# Altium project BMS.PrjPcb (part 2 of 2)

## Sheet BMS_Balancing.SchDoc
size 431 x 279 mm; SheetNumber: 5; SheetTotal: 6
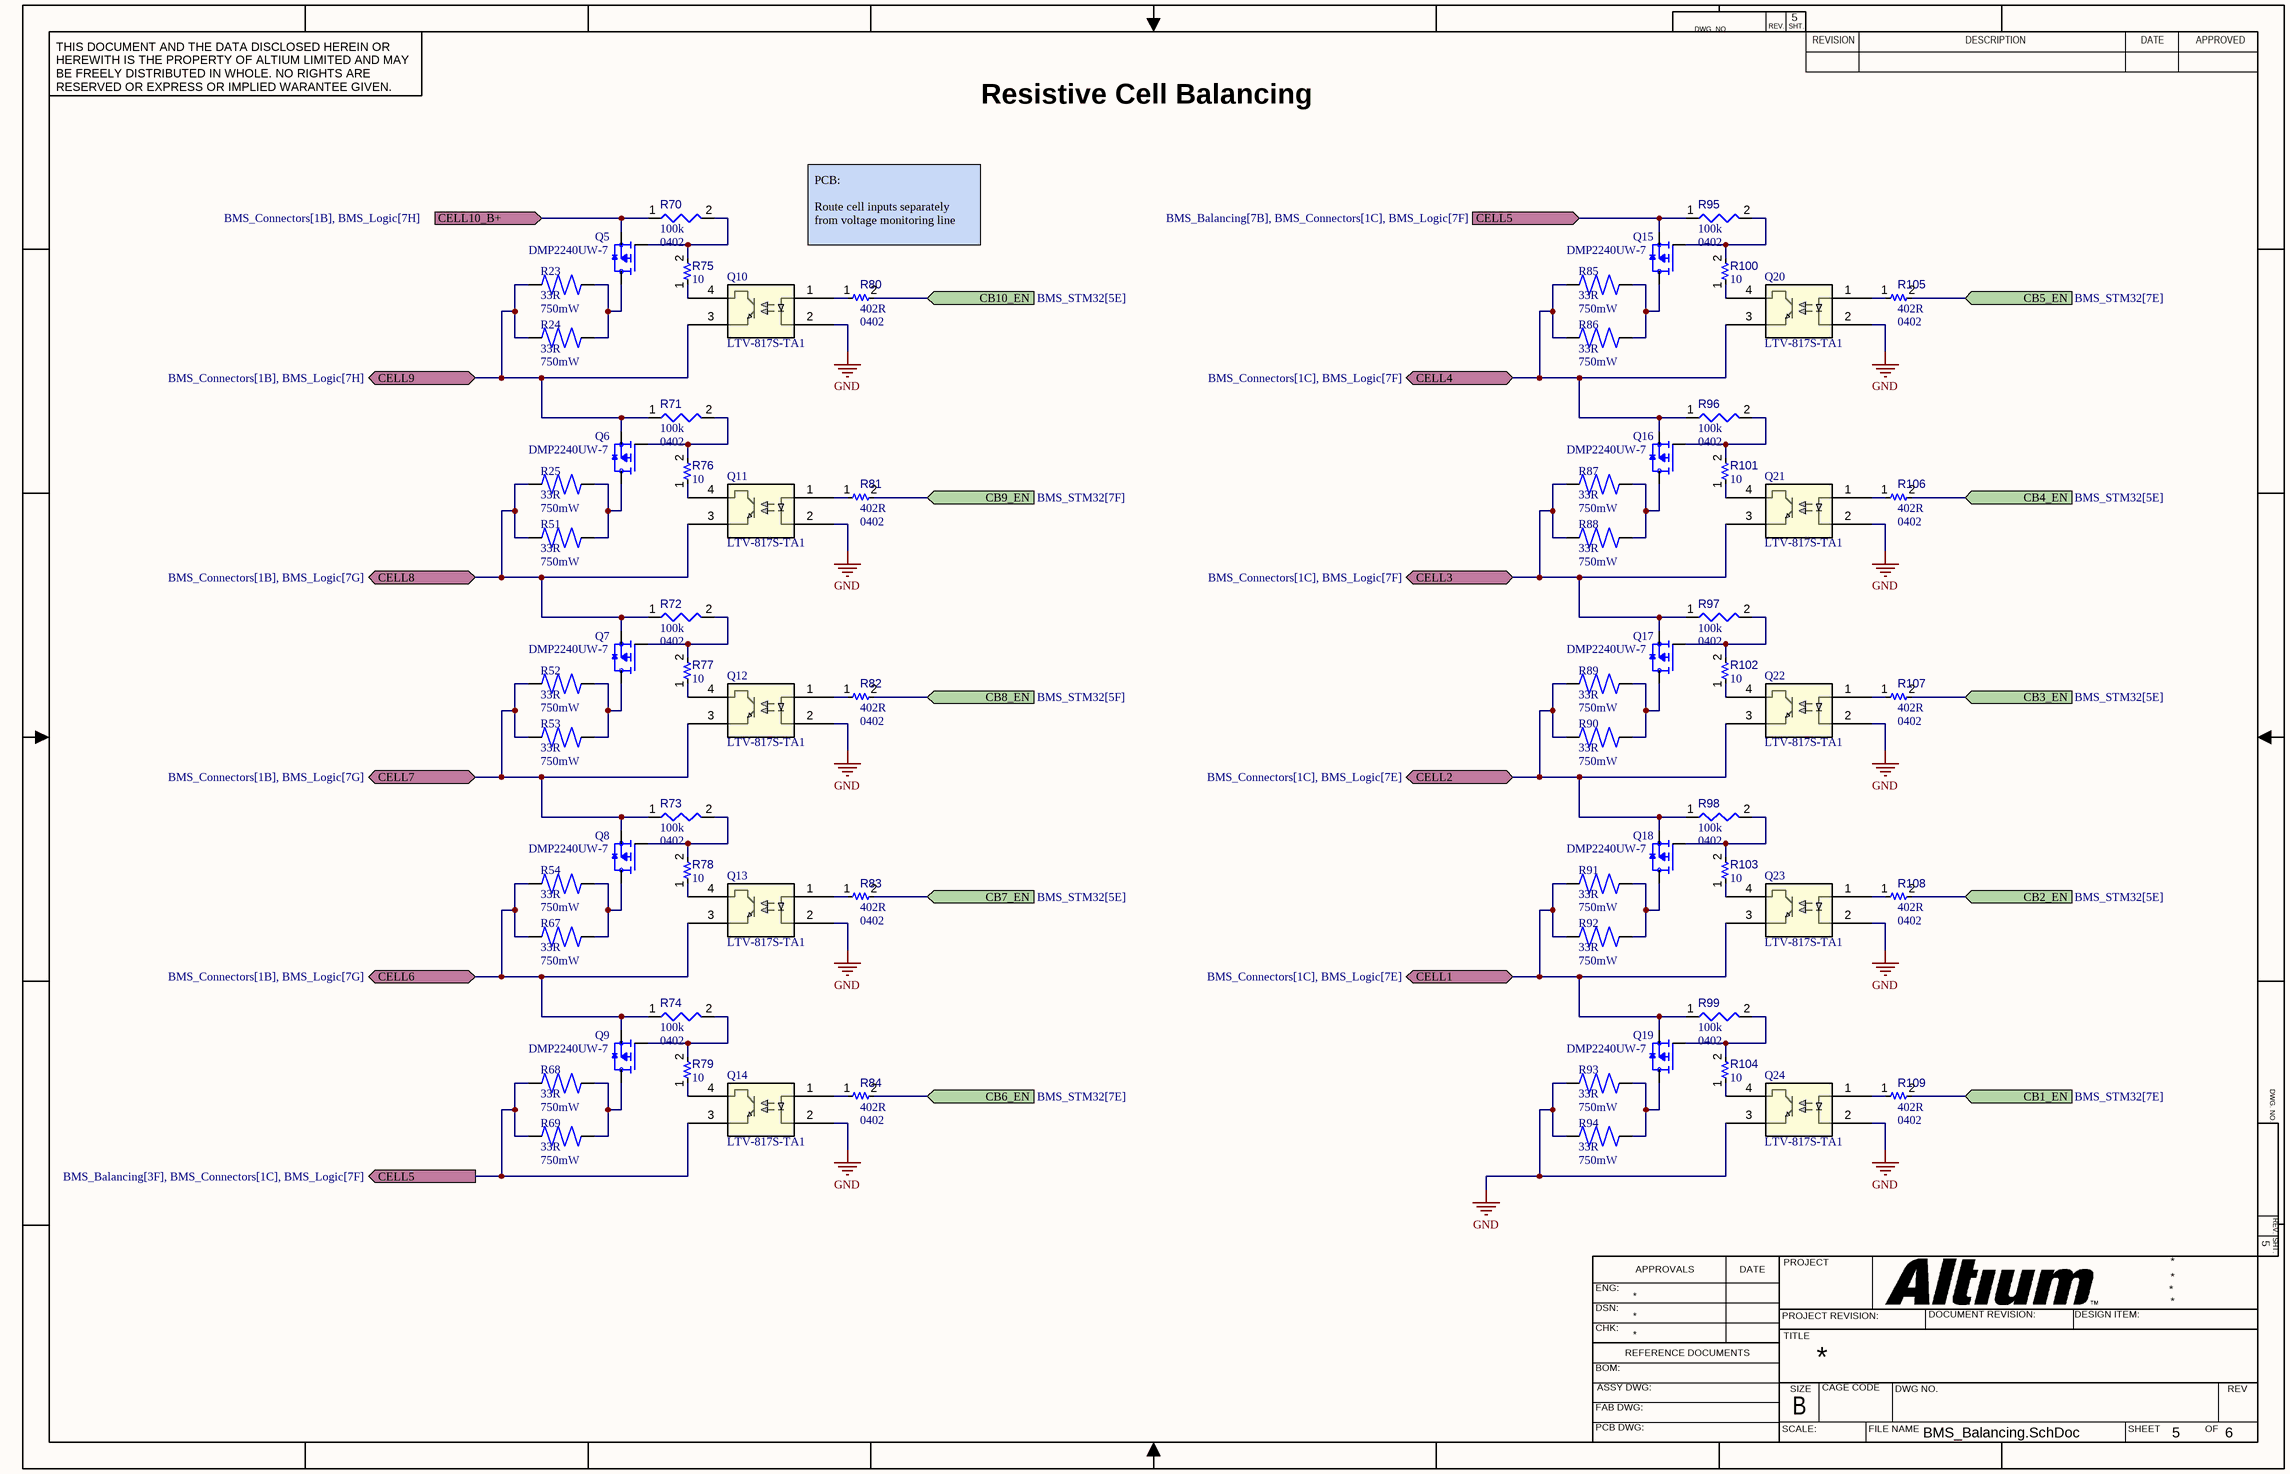
[diagram p7: BMS_Balancing.SchDoc]

### Parts
(Parts that share a designator on the sheet are numbered #1, #2 ... from top to bottom, then left to right.)
Q5  DMP2240UW-7  [SOT65P210X110-3N]
Q6  DMP2240UW-7  [SOT65P210X110-3N]
Q7  DMP2240UW-7  [SOT65P210X110-3N]
Q8  DMP2240UW-7  [SOT65P210X110-3N]
Q9  DMP2240UW-7  [SOT65P210X110-3N]
Q10  LTV-817S-TA1  [LTV-817S_LTO]
Q11  LTV-817S-TA1  [LTV-817S_LTO]
Q12  LTV-817S-TA1  [LTV-817S_LTO]
Q13  LTV-817S-TA1  [LTV-817S_LTO]
Q14  LTV-817S-TA1  [LTV-817S_LTO]
Q15  DMP2240UW-7  [SOT65P210X110-3N]
Q16  DMP2240UW-7  [SOT65P210X110-3N]
Q17  DMP2240UW-7  [SOT65P210X110-3N]
Q18  DMP2240UW-7  [SOT65P210X110-3N]
Q19  DMP2240UW-7  [SOT65P210X110-3N]
Q20  LTV-817S-TA1  [LTV-817S_LTO]
Q21  LTV-817S-TA1  [LTV-817S_LTO]
Q22  LTV-817S-TA1  [LTV-817S_LTO]
Q23  LTV-817S-TA1  [LTV-817S_LTO]
Q24  LTV-817S-TA1  [LTV-817S_LTO]
R23#2  value 33R  Power: 750mW  [RESC1632X70N]  (hidden comment: YAGEO AC0612FR-0733RL)
R24#2  value 33R  Power: 750mW  [RESC1632X70N]  (hidden comment: YAGEO AC0612FR-0733RL)
R25  value 33R  Power: 750mW  [RESC1632X70N]  (hidden comment: YAGEO AC0612FR-0733RL)
R51#1  value 33R  Power: 750mW  [RESC1632X70N]  (hidden comment: YAGEO AC0612FR-0733RL)
R52#1  value 33R  Power: 750mW  [RESC1632X70N]  (hidden comment: YAGEO AC0612FR-0733RL)
R53#1  value 33R  Power: 750mW  [RESC1632X70N]  (hidden comment: YAGEO AC0612FR-0733RL)
R54#1  value 33R  Power: 750mW  [RESC1632X70N]  (hidden comment: YAGEO AC0612FR-0733RL)
R67  value 33R  Power: 750mW  [RESC1632X70N]  (hidden comment: YAGEO AC0612FR-0733RL)
R68  value 33R  Power: 750mW  [RESC1632X70N]  (hidden comment: YAGEO AC0612FR-0733RL)
R69  value 33R  Power: 750mW  [RESC1632X70N]  (hidden comment: YAGEO AC0612FR-0733RL)
R70  value 100k  Case/Package: 0402  [RESC0402(1005)_L]  (hidden comment: CRCW0402100KJNED)
R71  value 100k  Case/Package: 0402  [RESC0402(1005)_L]  (hidden comment: CRCW0402100KJNED)
R72  value 100k  Case/Package: 0402  [RESC0402(1005)_L]  (hidden comment: CRCW0402100KJNED)
R73  value 100k  Case/Package: 0402  [RESC0402(1005)_L]  (hidden comment: CRCW0402100KJNED)
R74  value 100k  Case/Package: 0402  [RESC0402(1005)_L]  (hidden comment: CRCW0402100KJNED)
R75  value 10  [RESC0402(1005)_L]  (hidden comment: CL0402FN10RP)
R76  value 10  [RESC0402(1005)_L]  (hidden comment: CL0402FN10RP)
R77  value 10  [RESC0402(1005)_L]  (hidden comment: CL0402FN10RP)
R78  value 10  [RESC0402(1005)_L]  (hidden comment: CL0402FN10RP)
R79  value 10  [RESC0402(1005)_L]  (hidden comment: CL0402FN10RP)
R80  value 402R  Case/Package: 0402  [RESC0402(1005)_L]  (hidden comment: CR0402FF4020G)
R81  value 402R  Case/Package: 0402  [RESC0402(1005)_L]  (hidden comment: CR0402FF4020G)
R82  value 402R  Case/Package: 0402  [RESC0402(1005)_L]  (hidden comment: CR0402FF4020G)
R83  value 402R  Case/Package: 0402  [RESC0402(1005)_L]  (hidden comment: CR0402FF4020G)
R84  value 402R  Case/Package: 0402  [RESC0402(1005)_L]  (hidden comment: CR0402FF4020G)
R85  value 33R  Power: 750mW  [RESC1632X70N]  (hidden comment: YAGEO AC0612FR-0733RL)
R86  value 33R  Power: 750mW  [RESC1632X70N]  (hidden comment: YAGEO AC0612FR-0733RL)
R87  value 33R  Power: 750mW  [RESC1632X70N]  (hidden comment: YAGEO AC0612FR-0733RL)
R88  value 33R  Power: 750mW  [RESC1632X70N]  (hidden comment: YAGEO AC0612FR-0733RL)
R89  value 33R  Power: 750mW  [RESC1632X70N]  (hidden comment: YAGEO AC0612FR-0733RL)
R90  value 33R  Power: 750mW  [RESC1632X70N]  (hidden comment: YAGEO AC0612FR-0733RL)
R91  value 33R  Power: 750mW  [RESC1632X70N]  (hidden comment: YAGEO AC0612FR-0733RL)
R92  value 33R  Power: 750mW  [RESC1632X70N]  (hidden comment: YAGEO AC0612FR-0733RL)
R93  value 33R  Power: 750mW  [RESC1632X70N]  (hidden comment: YAGEO AC0612FR-0733RL)
R94  value 33R  Power: 750mW  [RESC1632X70N]  (hidden comment: YAGEO AC0612FR-0733RL)
R95  value 100k  Case/Package: 0402  [RESC0402(1005)_L]  (hidden comment: CRCW0402100KJNED)
R96  value 100k  Case/Package: 0402  [RESC0402(1005)_L]  (hidden comment: CRCW0402100KJNED)
R97  value 100k  Case/Package: 0402  [RESC0402(1005)_L]  (hidden comment: CRCW0402100KJNED)
R98  value 100k  Case/Package: 0402  [RESC0402(1005)_L]  (hidden comment: CRCW0402100KJNED)
R99  value 100k  Case/Package: 0402  [RESC0402(1005)_L]  (hidden comment: CRCW0402100KJNED)
R100  value 10  [RESC0402(1005)_L]  (hidden comment: CL0402FN10RP)
R101  value 10  [RESC0402(1005)_L]  (hidden comment: CL0402FN10RP)
R102  value 10  [RESC0402(1005)_L]  (hidden comment: CL0402FN10RP)
R103  value 10  [RESC0402(1005)_L]  (hidden comment: CL0402FN10RP)
R104  value 10  [RESC0402(1005)_L]  (hidden comment: CL0402FN10RP)
R105  value 402R  Case/Package: 0402  [RESC0402(1005)_L]  (hidden comment: CR0402FF4020G)
R106  value 402R  Case/Package: 0402  [RESC0402(1005)_L]  (hidden comment: CR0402FF4020G)
R107  value 402R  Case/Package: 0402  [RESC0402(1005)_L]  (hidden comment: CR0402FF4020G)
R108  value 402R  Case/Package: 0402  [RESC0402(1005)_L]  (hidden comment: CR0402FF4020G)
R109  value 402R  Case/Package: 0402  [RESC0402(1005)_L]  (hidden comment: CR0402FF4020G)

### Ports
CB1_EN (in, see BMS_STM32[7E]), CB2_EN (in, see BMS_STM32[5E]), CB3_EN (in, see BMS_STM32[5E]), CB4_EN (in, see BMS_STM32[5E]), CB5_EN (in, see BMS_STM32[7E]), CB6_EN (in, see BMS_STM32[7E]), CB7_EN (in, see BMS_STM32[5E]), CB8_EN (in, see BMS_STM32[5F]), CB9_EN (in, see BMS_STM32[7F]), CB10_EN (in, see BMS_STM32[5E]), CELL1 (bidir, see BMS_Connectors[1C], BMS_Logic[7E]), CELL2 (bidir, see BMS_Connectors[1C], BMS_Logic[7E]), CELL3 (bidir, see BMS_Connectors[1C], BMS_Logic[7F]), CELL4 (bidir, see BMS_Connectors[1C], BMS_Logic[7F]), CELL5 (in, see BMS_Balancing[7B], BMS_Connectors[1C], BMS_Logic[7F]), CELL5 (out, see BMS_Balancing[3F], BMS_Connectors[1C], BMS_Logic[7F]), CELL6 (bidir, see BMS_Connectors[1B], BMS_Logic[7G]), CELL7 (bidir, see BMS_Connectors[1B], BMS_Logic[7G]), CELL8 (bidir, see BMS_Connectors[1B], BMS_Logic[7G]), CELL9 (bidir, see BMS_Connectors[1B], BMS_Logic[7H]), CELL10_B+ (in, see BMS_Connectors[1B], BMS_Logic[7H])

### Nets
B+: Q5.2(S) R70.1 ; port CELL10_B+
GND: Q10.2 Q11.2 Q12.2 Q13.2 Q14.2 Q20.2 Q21.2 Q22.2 Q23.2 Q24.2 Q24.3 R93.1 R94.1
CB1_EN: R109.2 ; port CB1_EN
CB2_EN: R108.2 ; port CB2_EN
CB3_EN: R107.2 ; port CB3_EN
CB4_EN: R106.2 ; port CB4_EN
CB5_EN: R105.2 ; port CB5_EN
CB6_EN: R84.2 ; port CB6_EN
CB7_EN: R83.2 ; port CB7_EN
CB8_EN: R82.2 ; port CB8_EN
CB9_EN: R81.2 ; port CB9_EN
CB10_EN: R80.2 ; port CB10_EN
CELL1: Q19.2(S) Q23.3 R91.1 R92.1 R99.1 ; port CELL1
CELL2: Q18.2(S) Q22.3 R89.1 R90.1 R98.1 ; port CELL2
CELL3: Q17.2(S) Q21.3 R87.1 R88.1 R97.1 ; port CELL3
CELL4: Q16.2(S) Q20.3 R85.1 R86.1 R96.1 ; port CELL4
CELL5: Q14.3 Q15.2(S) R68.1 R69.1 R95.1 ; port CELL5
CELL6: Q9.2(S) Q13.3 R54#1.1 R67.1 R74.1 ; port CELL6
CELL7: Q8.2(S) Q12.3 R52#1.1 R53#1.1 R73.1 ; port CELL7
CELL8: Q7.2(S) Q11.3 R25.1 R51#1.1 R72.1 ; port CELL8
CELL9: Q6.2(S) Q10.3 R23#2.1 R24#2.1 R71.1 ; port CELL9
NetQ5_1: Q5.1(G) R70.2 R75.2
NetQ5_3: Q5.3(D) R23#2.2 R24#2.2
NetQ6_1: Q6.1(G) R71.2 R76.2
NetQ6_3: Q6.3(D) R25.2 R51#1.2
NetQ7_1: Q7.1(G) R72.2 R77.2
NetQ7_3: Q7.3(D) R52#1.2 R53#1.2
NetQ8_1: Q8.1(G) R73.2 R78.2
NetQ8_3: Q8.3(D) R54#1.2 R67.2
NetQ9_1: Q9.1(G) R74.2 R79.2
NetQ9_3: Q9.3(D) R68.2 R69.2
NetQ10_1: Q10.1 R80.1
NetQ10_4: Q10.4 R75.1
NetQ11_1: Q11.1 R81.1
NetQ11_4: Q11.4 R76.1
NetQ12_1: Q12.1 R82.1
NetQ12_4: Q12.4 R77.1
NetQ13_1: Q13.1 R83.1
NetQ13_4: Q13.4 R78.1
NetQ14_1: Q14.1 R84.1
NetQ14_4: Q14.4 R79.1
NetQ15_1: Q15.1(G) R95.2 R100.2
NetQ15_3: Q15.3(D) R85.2 R86.2
NetQ16_1: Q16.1(G) R96.2 R101.2
NetQ16_3: Q16.3(D) R87.2 R88.2
NetQ17_1: Q17.1(G) R97.2 R102.2
NetQ17_3: Q17.3(D) R89.2 R90.2
NetQ18_1: Q18.1(G) R98.2 R103.2
NetQ18_3: Q18.3(D) R91.2 R92.2
NetQ19_1: Q19.1(G) R99.2 R104.2
NetQ19_3: Q19.3(D) R93.2 R94.2
NetQ20_1: Q20.1 R105.1
NetQ20_4: Q20.4 R100.1
NetQ21_1: Q21.1 R106.1
NetQ21_4: Q21.4 R101.1
NetQ22_1: Q22.1 R107.1
NetQ22_4: Q22.4 R102.1
NetQ23_1: Q23.1 R108.1
NetQ23_4: Q23.4 R103.1
NetQ24_1: Q24.1 R109.1
NetQ24_4: Q24.4 R104.1

### Notes on the sheet
- Resistive Cell Balancing
- PCB:
  Route cell inputs separately from voltage monitoring line
- DWG. NO.
- REV.
- SHT.
- THIS DOCUMENT AND THE DATA DISCLOSED HEREIN OR HEREWITH IS THE PROPERTY OF ALTIUM LIMITED AND MAY BE FREELY DISTRIBUTED IN WHOLE. NO RIGHTS ARE RESERVED OR EXPRESS OR IMPLIED WARANTEE GIVEN.
- REVISION
- DESCRIPTION
- DATE
- APPROVED
- ENG:
- APPROVALS
- PROJECT
- DSN:
- CHK:
- REFERENCE DOCUMENTS
- PROJECT REVISION:
- TITLE
- DOCUMENT REVISION:
- DESIGN ITEM:
- BOM:
- FAB DWG:
- PCB DWG:
- ASSY DWG:
- SCALE:
- SIZE
- B
- CAGE CODE
- FILE NAME
- DWG NO.
- SHEET
- OF
- REV

### Library data of the parts
Q5-Q9 Q15-Q19 = CMP-147-000000-1: P-Channel Enhancement FET SOT-323; MF: Diodes Inc.; Package: SOT-323 Diodes Inc.; SnapEDA_Link: https://www.snapeda.com/parts/DMP2240UW-7/Diodes+Inc./view-part/?ref=snap; Check_prices: https://www.snapeda.com/parts/DMP2240UW-7/Diodes+Inc./view-part/?ref=eda; Value: *; Pin Count: 3; Source: DMP2240UW-7.SchLib; MP: DMP2240UW-7; Component Type: Standard; Design Item ID: DMP2240UW-7
Q10-Q14 Q20-Q24 = CMP-143-000000-2: No Description Available; Manufacturer_Name: LITE-ON; Source: LTV-817S-TA1.SchLib; RefDes: RefDes; Design Item ID: LTV-817S-TA1; Copyright: Copyright (C) 2025 Ultra Librarian. All rights reserved.; Type: Type; Manufacturer_Part_Number: LTV-817S-TA1
R23#2 R24#2 R25 R51#1 R52#1 R53#1 R54#1 R67-R69 R85-R94 = CMP-009-00178-3: 750 mOhms Â±1% 1W Chip Resistor 0612 (1632 Metric) Automotive AEC-Q200, Current Sense, Moisture Resistant Thick Film; MF: Vishay Dale; Case/Package: 1632 Vishay; SnapEDA_Link: https://www.snapeda.com/parts/RCWE0612R750FKEA/Vishay+Dale/view-part/?ref=snap; Check_prices: https://www.snapeda.com/parts/RCWE0612R750FKEA/Vishay+Dale/view-part/?ref=eda; Source: RCWE0612R750FKEA.SchLib; MP: RCWE0612R750FKEA; Design Item ID: RCWE0612R750FKEA
R70-R74 R95-R99 = CMP-009-00064-2: 100K 0.063W 1% 0402 (1005 Metric)  SMD; Power: 63mW; Mounting Technology: SMT; Pins: 2; Tolerance: 1%
R75-R84 R100-R109 = CMP-009-00065-4: 100R 0.063W 1% 0402 (1005 Metric)  SMD; Power: 63mW; Tolerance: 1%; Pins: 2; Mounting Technology: SMT
  R75-R79 R100-R104: Case/Package: 0402

## Sheet BMS_Protection.SchDoc
size 431 x 279 mm; SheetNumber: 6; SheetTotal: 5
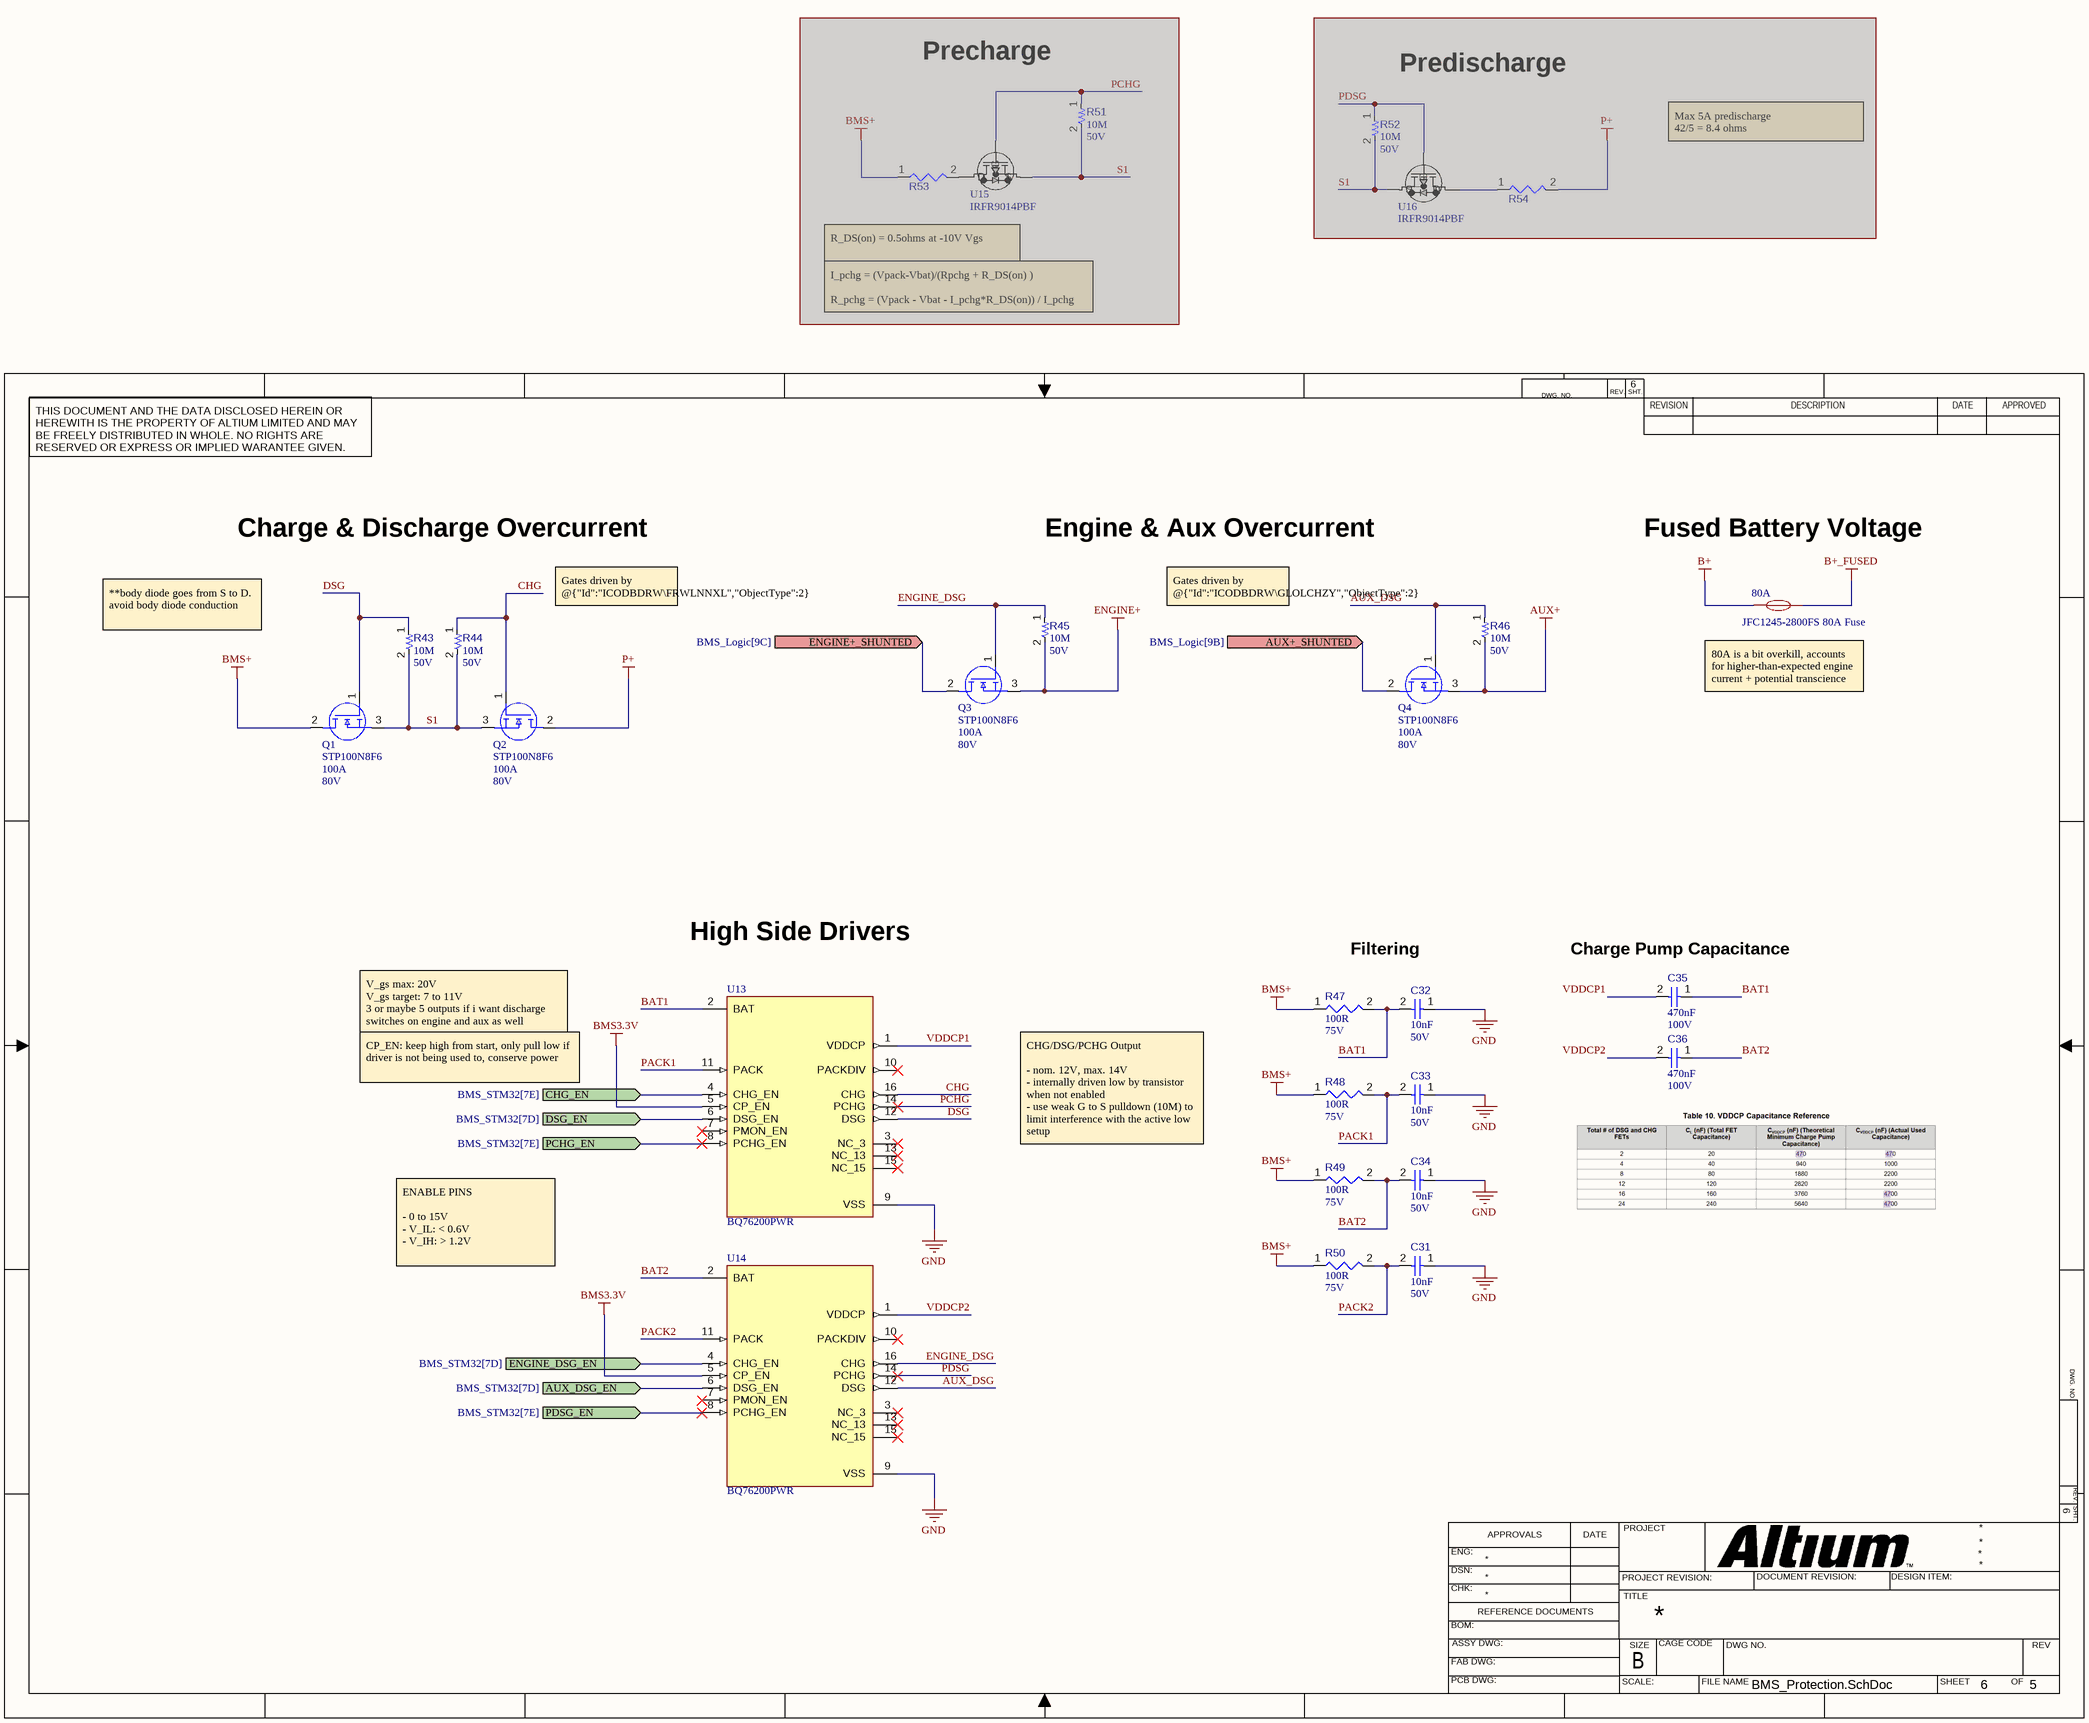
[diagram p8: BMS_Protection.SchDoc]

### Parts
(Parts that share a designator on the sheet are numbered #1, #2 ... from top to bottom, then left to right.)
C31  value 10nF  Voltage Rating: 50V  [CAPC0402(1005)60_L]  (hidden comment: CC0603KRX7R0BB103)
C32  value 10nF  Voltage Rating: 50V  [CAPC0402(1005)60_L]  (hidden comment: CC0603KRX7R0BB103)
C33  value 10nF  Voltage Rating: 50V  [CAPC0402(1005)60_L]  (hidden comment: CC0603KRX7R0BB103)
C34  value 10nF  Voltage Rating: 50V  [CAPC0402(1005)60_L]  (hidden comment: CC0603KRX7R0BB103)
C35  value 470nF  Voltage Rating: 100V  [CAPC0805(2012)145_L]  (hidden comment: CC0805KKX7R0BB474)
C36  value 470nF  Voltage Rating: 100V  [CAPC0805(2012)145_L]  (hidden comment: CC0805KKX7R0BB474)
F1  JFC1245-2800FS 80A Fuse  Current Rating: 80A  [FUSE-SMD_L12.5-W4.5]
Q1  STP100N8F6  Drain current continuous at Tc = 25°C: 100A  Drain Source Breakdown Voltage Vds: 80V  [TO255P460X1020X2008-3P]
Q2  STP100N8F6  Drain current continuous at Tc = 25°C: 100A  Drain Source Breakdown Voltage Vds: 80V  [TO255P460X1020X2008-3P]
Q3  STP100N8F6  Drain current continuous at Tc = 25°C: 100A  Drain Source Breakdown Voltage Vds: 80V  [TO255P460X1020X2008-3P]
Q4  STP100N8F6  Drain current continuous at Tc = 25°C: 100A  Drain Source Breakdown Voltage Vds: 80V  [TO255P460X1020X2008-3P]
R43  value 10M  Voltage Rating: 50V  [RESC0402(1005)_L]  (hidden comment: RC0402FR-0710ML)
R44  value 10M  Voltage Rating: 50V  [RESC0402(1005)_L]  (hidden comment: RC0402FR-0710ML)
R45  value 10M  Voltage Rating: 50V  [RESC0402(1005)_L]  (hidden comment: RC0402FR-0710ML)
R46  value 10M  Voltage Rating: 50V  [RESC0402(1005)_L]  (hidden comment: RC0402FR-0710ML)
R47  value 100R  Voltage Rating: 75V  [RESC0603(1608)_L]  (hidden comment: RC0603FR-07100RL)
R48  value 100R  Voltage Rating: 75V  [RESC0603(1608)_L]  (hidden comment: RC0603FR-07100RL)
R49  value 100R  Voltage Rating: 75V  [RESC0603(1608)_L]  (hidden comment: RC0603FR-07100RL)
R50  value 100R  Voltage Rating: 75V  [RESC0603(1608)_L]  (hidden comment: RC0603FR-07100RL)
R51#2  value 10M  Voltage Rating: 50V  [RESC0402(1005)_L]  (hidden comment: RC0402FR-0710ML)  (masked out: inside a compile mask, not in the netlist)
R52#2  value 10M  Voltage Rating: 50V  [RESC0402(1005)_L]  (hidden comment: RC0402FR-0710ML)  (masked out: inside a compile mask, not in the netlist)
R53#2  Resistors  (value not drawn)  (masked out: inside a compile mask, not in the netlist)
R54#2  Resistors  (value not drawn)  (masked out: inside a compile mask, not in the netlist)
U13  BQ76200PWR  [SOP65P640X120-16N]
U14  BQ76200PWR  [SOP65P640X120-16N]
U15  IRFR9014PBF  [DPAK_VIS]  (masked out: inside a compile mask, not in the netlist)
U16  IRFR9014PBF  [DPAK_VIS]  (masked out: inside a compile mask, not in the netlist)

### Ports
AUX+_SHUNTED (in, see BMS_Logic[9B]), AUX_DSG_EN (in, see BMS_STM32[7D]), CHG_EN (in, see BMS_STM32[7E]), DSG_EN (in, see BMS_STM32[7D]), ENGINE+_SHUNTED (in, see BMS_Logic[9C]), ENGINE_DSG_EN (in, see BMS_STM32[7D]), PCHG_EN (in, see BMS_STM32[7E]), PDSG_EN (in, see BMS_STM32[7E])

### Nets
AUX+: Q4.3(S) R46.2
B+: F1.1
B+_FUSED: F1.2
BMS3.3V: U13.5(CP_EN) U14.5(CP_EN)
BMS+: Q1.2(D) R47.1 R48.1 R49.1 R50.1
ENGINE+: Q3.3(S) R45.2
GND: C31.1 C32.1 C33.1 C34.1 U13.9(VSS) U14.9(VSS)
P+: Q2.2(D)
AUX+_SHUNTED: Q4.2(D) ; port AUX+_SHUNTED
AUX_DSG: Q4.1(G) R46.1 U14.12(DSG)
AUX_DSG_EN: U14.6(DSG_EN) ; port AUX_DSG_EN
BAT1: C32.2 C35.1 R47.2 U13.2(BAT)
BAT2: C34.2 C36.1 R49.2 U14.2(BAT)
CHG: Q2.1(G) R44.1 U13.16(CHG)
CHG_EN: U13.4(CHG_EN) ; port CHG_EN
DSG: Q1.1(G) R43.1 U13.12(DSG)
DSG_EN: U13.6(DSG_EN) ; port DSG_EN
ENGINE+_SHUNTED: Q3.2(D) ; port ENGINE+_SHUNTED
ENGINE_DSG: Q3.1(G) R45.1 U14.16(CHG)
ENGINE_DSG_EN: U14.4(CHG_EN) ; port ENGINE_DSG_EN
PACK1: C33.2 R48.2 U13.11(PACK)
PACK2: C31.2 R50.2 U14.11(PACK)
PCHG: U13.14(PCHG)
PCHG_EN: U13.8(PCHG_EN) ; port PCHG_EN
PDSG: U14.14(PCHG)
PDSG_EN: U14.8(PCHG_EN) ; port PDSG_EN
S1: Q1.3(S) Q2.3(S) R43.2 R44.2
VDDCP1: C35.2 U13.1(VDDCP)
VDDCP2: C36.2 U14.1(VDDCP)

Not connected (* = marked no-connect by the designer): U13 3(NC_3)* 7(PMON_EN)* 10(PACKDIV)* 13(NC_13)* 15(NC_15)*; U14 3(NC_3)* 7(PMON_EN)* 10(PACKDIV)* 13(NC_13)* 15(NC_15)*

### Notes on the sheet
- Precharge
- (near R52#2) Predischarge
- Max 5A predischarge
  42/5 = 8.4 ohms
- R_DS(on) = 0.5ohms at -10V Vgs
- I_pchg = (Vpack-Vbat)/(Rpchg + R_DS(on) )
  R_pchg = (Vpack - Vbat - I_pchg*R_DS(on)) / I_pchg
- Charge & Discharge Overcurrent
- Engine & Aux Overcurrent
- Fused Battery Voltage
- **body diode goes from S to D. avoid body diode conduction
- Gates driven by @{"Id":"ICODBDRW\FRWLNNXL","ObjectType":2}
- Gates driven by @{"Id":"ICODBDRW\GLOLCHZY","ObjectType":2}
- (near F1) 80A is a bit overkill, accounts for higher-than-expected engine current + potential transcience
- High Side Drivers
- Filtering
- (near C35) Charge Pump Capacitance
- V_gs max: 20V
  V_gs target: 7 to 11V
  3 or maybe 5 outputs if i want discharge switches on engine and aux as well
- CP_EN: keep high from start, only pull low if driver is not being used to, conserve power
- CHG/DSG/PCHG Output
  - nom. 12V, max. 14V
  - internally driven low by transistor when not enabled
  - use weak G to S pulldown (10M) to limit interference with the active low setup
- ENABLE PINS
  - 0 to 15V
  - V_IL: < 0.6V
  - V_IH: > 1.2V
- DWG. NO.
- REV.
- SHT.
- THIS DOCUMENT AND THE DATA DISCLOSED HEREIN OR HEREWITH IS THE PROPERTY OF ALTIUM LIMITED AND MAY BE FREELY DISTRIBUTED IN WHOLE. NO RIGHTS ARE RESERVED OR EXPRESS OR IMPLIED WARANTEE GIVEN.
- REVISION
- DESCRIPTION
- DATE
- APPROVED
- ENG:
- APPROVALS
- PROJECT
- DSN:
- CHK:
- REFERENCE DOCUMENTS
- PROJECT REVISION:
- TITLE
- DOCUMENT REVISION:
- DESIGN ITEM:
- BOM:
- FAB DWG:
- PCB DWG:
- ASSY DWG:
- SCALE:
- SIZE
- B
- CAGE CODE
- FILE NAME
- DWG NO.
- SHEET
- OF
- REV

### Library data of the parts
C31-C34 = CMP-001-00069-3: Chip Capacitor, 10nF +/-20%, 50V, 0402, Thickness 0.6 mm; Tolerance: 5%; Mounting Technology: SMT; Case/Package: 0402; Pins: 2; Min Operating Temperature: -55°C; Max Operating Temperature: 85°C
C35 C36 = CMP-001-00082-4: Chip Capacitor, 47µF +/-40%, 6.3V, 0805, Thickness 1.45 mm; Tolerance: 10%; Mounting Technology: SMT; Case/Package: 0805; Pins: 2; Min Operating Temperature: -55°C; Max Operating Temperature: 85°C
F1 = CMP-005-00013-2: Manufacturer: JDTfuse(集电通); Voltage Rating (AC): 600V; Add into BOM: yes; Voltage Rating (DC): 250V; Type: Surface Mount Fuse; Melting I2t: 5270; Datasheet: https://atta.szlcsc.com/upload/public/pdf/source/20250508/CF412184D6CDD19FE95AA7AB21E198C3.pdf; Design Item ID: JFC1245-2800FS; JLCPCB Part Class: Extended Part; Operating Temperature: -55℃~+125℃; LCSC Part Name: 一次性熔断保险丝; Supplier Part: C48783191; Length: 12.45mm; Device: JFC1245-2800FS; Source: JFC1245-2800FS1_JFC1245-2800FS.SCHLIB; Symbol: JFC1245-2800FS; Manufacturer Part: JFC1245-2800FS; Supplier Footprint: SMD,12.5x4.5mm; Convert to PCB: yes; Width: 4.5mm
Q1-Q4 = CMP-120-000000-8: MOSFET POWER MOSFET; Manufacturer_Name: STMicroelectronics; Geometry.Height: 4.6mm; Vgs (Max): 20V; Drain current continuous at Tc = 100°C: 70A; Nominal Vgs: 3V; RtjA: 62.5°C/W; Pulsed Drain Current: 400A; RtjC: 0.85°C/W; Forward On Voltage (Vgs = 0V, Isd = 100A): 1.2V; Source: STP100N8F6.SchLib; Manufacturer_Part_Number: STP100N8F6; Design Item ID: STP100N8F6; Datasheet Link: https://www.st.com/resource/en/datasheet/stp100n8f6.pdf; Mouser Part Number: 511-STP100N8F6; Mouser Price/Stock: https://www.mouser.co.uk/ProductDetail/STMicroelectronics/STP100N8F6?qs=JkuGhO7zlpk0tv8q3dz9Ww%3D%3D; Min Operating Temperature: -55°C; Max Operating Temperature: 175°C; Transistor Type: MOSFET
R43-R46 R51#2 R52#2 = CMP-009-00065-4: as R75 on sheet BMS_Balancing; Mounting Technology: SMT; Case/Package: 0402; Pins: 2; Tolerance: 1%
R47-R50 = CMP-009-00069-2: 120R 0.1W 5% 0603 (1608 Metric)  SMD; Power: 100mW; Mounting Technology: SMT; Case/Package: 0603; Pins: 2; Tolerance: 5%
R53#2 R54#2 = Resistors: Resistor; Component Type: Resistors
U13 U14 = CMP-122-000000-1: High-side n-channel FET driver; MF: Texas Instruments; Source: BQ76200PWR.SchLib; Value: *; Pin Count: 16; MP: BQ76200PWR; Package: TSSOP-16 Texas Instruments; Component Type: Standard; Design Item ID: BQ76200PWR; Check_prices: https://www.snapeda.com/parts/BQ76200PWR/Texas+Instruments/view-part/?ref=eda; SnapEDA_Link: https://www.snapeda.com/parts/BQ76200PWR/Texas+Instruments/view-part/?ref=snap
U15 U16 = CMP-125-000000-1: MOSFET P-CHANNEL 60V; Manufacturer_Name: Vishay; Source: IRFR9014PBF.SchLib; Datasheet: https://www.vishay.com/doc?91277; Copyright: Copyright (C) 2025 Ultra Librarian. All rights reserved.; Manufacturer_Part_Number: IRFR9014PBF; Design Item ID: IRFR9014PBF

## Nets that join several sheets
AUX+: BMS_Connectors (J3.2), BMS_Protection (Q4.3 R46.2)
B+: BMS_Connectors (D3.C J1.2 J5.1), BMS_Logic (R3.2), BMS_Balancing (Q5.2 R70.1), BMS_Protection (F1.1)
B+_FUSED: BMS_Logic (R36.2 R55.1 U7.8), BMS_Protection (F1.2)
BMS3.3V: BMS_STM32 (19 pins), BMS_Connectors (J7.4 J8.2 J9.2 J10.2), BMS_PowerRegulation (C30.2 R110.2 U12.5), BMS_Logic (12 pins), BMS_Protection (U13.5 U14.5)
BMS+: BMS_PowerRegulation (C23.1 U10.1), BMS_Logic (R37.2 R55.2), BMS_Protection (5 pins)
ENGINE+: BMS_Connectors (J2.2), BMS_Protection (Q3.3 R45.2)
GND: BMS_STM32 (31 pins), BMS_Connectors (11 pins), BMS_PowerRegulation (15 pins), BMS_Logic (23 pins), BMS_Balancing (13 pins), BMS_Protection (6 pins)
P+: BMS_Connectors (D4.C J4.2), BMS_Logic (6 pins), BMS_Protection (Q2.2)
AUX+_SHUNTED: BMS_Logic (R42.2 R57.2), BMS_Protection (Q4.2)
AUX_DSG_EN: BMS_STM32 (U1.33), BMS_Protection (U14.6)
C1_ADC: BMS_STM32 (U1.22), BMS_Logic (R35.2)
C2_ADC: BMS_STM32 (U1.14), BMS_Logic (R27.2)
C3_ADC: BMS_STM32 (U1.15), BMS_Logic (R28.2)
C4_ADC: BMS_STM32 (U1.10), BMS_Logic (R29.2)
C5_ADC: BMS_STM32 (U1.11), BMS_Logic (R30.2)
C6_ADC: BMS_STM32 (U1.16), BMS_Logic (R31.2)
C7_ADC: BMS_STM32 (U1.26), BMS_Logic (R26.2)
C8_ADC: BMS_STM32 (U1.20), BMS_Logic (R33.2)
C9_ADC: BMS_STM32 (U1.21), BMS_Logic (R34.2)
C10_ADC: BMS_STM32 (U1.17), BMS_Logic (R32.2)
CAN_H: BMS_STM32 (D1.1 R1.2 U2.7), BMS_Connectors (J6.1)
CAN_L: BMS_STM32 (D1.2 R2.1 U2.6), BMS_Connectors (J6.2)
CB1_EN: BMS_STM32 (U1.43), BMS_Balancing (R109.2)
CB2_EN: BMS_STM32 (U1.51), BMS_Balancing (R108.2)
CB3_EN: BMS_STM32 (U1.52), BMS_Balancing (R107.2)
CB4_EN: BMS_STM32 (U1.53), BMS_Balancing (R106.2)
CB5_EN: BMS_STM32 (U1.42), BMS_Balancing (R105.2)
CB6_EN: BMS_STM32 (U1.41), BMS_Balancing (R84.2)
CB7_EN: BMS_STM32 (U1.40), BMS_Balancing (R83.2)
CB8_EN: BMS_STM32 (U1.38), BMS_Balancing (R82.2)
CB9_EN: BMS_STM32 (U1.23), BMS_Balancing (R81.2)
CB10_EN: BMS_STM32 (U1.39), BMS_Balancing (R80.2)
CELL1: BMS_Connectors (J5.10), BMS_Logic (R21.2), BMS_Balancing (5 pins)
CELL2: BMS_Connectors (J5.9), BMS_Logic (R19.2), BMS_Balancing (5 pins)
CELL3: BMS_Connectors (J5.8), BMS_Logic (R17.2), BMS_Balancing (5 pins)
CELL4: BMS_Connectors (J5.7), BMS_Logic (R15.2), BMS_Balancing (5 pins)
CELL5: BMS_Connectors (J5.6), BMS_Logic (R13.2), BMS_Balancing (5 pins)
CELL6: BMS_Connectors (J5.5), BMS_Logic (R11.2), BMS_Balancing (5 pins)
CELL7: BMS_Connectors (J5.4), BMS_Logic (R9.2), BMS_Balancing (5 pins)
CELL8: BMS_Connectors (J5.3), BMS_Logic (R7.2), BMS_Balancing (5 pins)
CELL9: BMS_Connectors (J5.2), BMS_Logic (R5.2), BMS_Balancing (5 pins)
CHG_EN: BMS_STM32 (U1.28), BMS_Protection (U13.4)
DSG_EN: BMS_STM32 (U1.29), BMS_Protection (U13.6)
ENGINE+_SHUNTED: BMS_Logic (R40.2 R56.2), BMS_Protection (Q3.2)
ENGINE_DSG_EN: BMS_STM32 (U1.30), BMS_Protection (U14.4)
PACK_MON_INT: BMS_STM32 (U1.36), BMS_Logic (R38.1 U7.3)
PACK_MON_SCL: BMS_STM32 (R58.1 U1.34), BMS_Logic (U7.5 U8.5 U9.5)
PACK_MON_SDA: BMS_STM32 (R59.1 U1.35), BMS_Logic (U7.4 U8.4 U9.4)
RESET: BMS_STM32 (C13.2 SW1.1 U1.7), BMS_Connectors (J7.2)
SWCLK: BMS_STM32 (U1.46), BMS_Connectors (J7.3)
SWDIO: BMS_STM32 (U1.49), BMS_Connectors (J7.1)
SWO: BMS_STM32 (U1.55), BMS_Connectors (J7.5)
THERM1: BMS_STM32 (U1.27), BMS_Connectors (J8.1 R64.1)
THERM2: BMS_STM32 (U1.25), BMS_Connectors (J9.1 R65.1)
THERM3: BMS_STM32 (U1.24), BMS_Connectors (J10.1 R66.1)